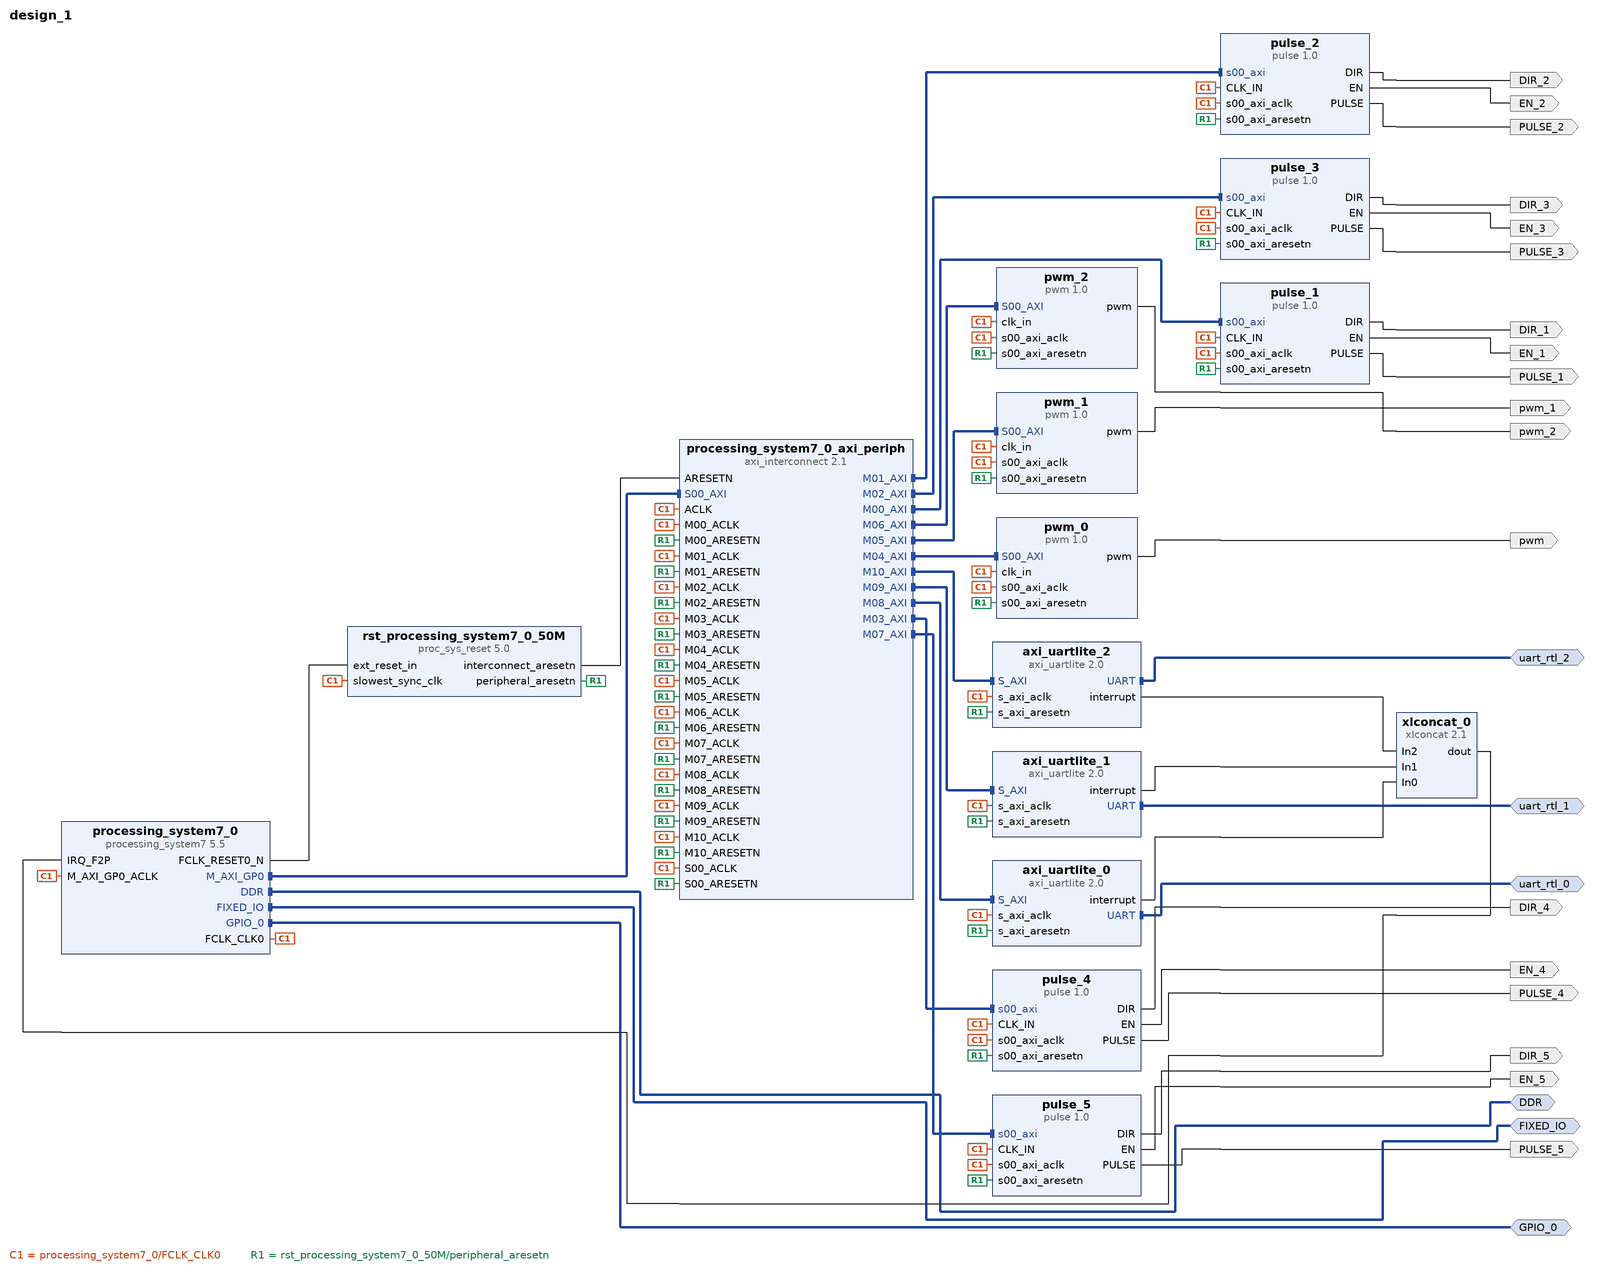
[diagram p0: block diagram of the top level]
# Vivado block design design_1, Vivado 2015.4
create_bd_design design_1

create_bd_intf_port -mode Master -vlnv xilinx.com:interface:ddrx_rtl:1.0 DDR
create_bd_intf_port -mode Master -vlnv xilinx.com:display_processing_system7:fixedio_rtl:1.0 FIXED_IO
create_bd_intf_port -mode Master -vlnv xilinx.com:interface:gpio_rtl:1.0 GPIO_0
create_bd_intf_port -mode Master -vlnv xilinx.com:interface:uart_rtl:1.0 uart_rtl_0
create_bd_intf_port -mode Master -vlnv xilinx.com:interface:uart_rtl:1.0 uart_rtl_1
create_bd_intf_port -mode Master -vlnv xilinx.com:interface:uart_rtl:1.0 uart_rtl_2
create_bd_port -dir O PULSE_1
create_bd_port -dir O EN_1
create_bd_port -dir O DIR_1
create_bd_port -dir O PULSE_2
create_bd_port -dir O EN_2
create_bd_port -dir O DIR_2
create_bd_port -dir O PULSE_3
create_bd_port -dir O EN_3
create_bd_port -dir O DIR_3
create_bd_port -dir O PULSE_4
create_bd_port -dir O EN_4
create_bd_port -dir O DIR_4
create_bd_port -dir O pwm
create_bd_port -dir O pwm_1
create_bd_port -dir O pwm_2
create_bd_port -dir O PULSE_5
create_bd_port -dir O EN_5
create_bd_port -dir O DIR_5

create_bd_cell -type ip -vlnv xilinx.com:ip:processing_system7:5.5 processing_system7_0
set_property -dict [list \
  CONFIG.PCW_SDIO_PERIPHERAL_FREQMHZ 125 \
  CONFIG.PCW_USE_FABRIC_INTERRUPT 1 \
  CONFIG.PCW_IRQ_F2P_INTR 1 \
  CONFIG.PCW_PRESET_BANK1_VOLTAGE {LVCMOS 1.8V} \
  CONFIG.PCW_UIPARAM_DDR_PARTNO {MT41J256M16 RE-125} \
  CONFIG.PCW_QSPI_PERIPHERAL_ENABLE 1 \
  CONFIG.PCW_QSPI_QSPI_IO {MIO 1 .. 6} \
  CONFIG.PCW_QSPI_GRP_SINGLE_SS_ENABLE 1 \
  CONFIG.PCW_QSPI_GRP_FBCLK_ENABLE 1 \
  CONFIG.PCW_QSPI_GRP_FBCLK_IO {MIO 8} \
  CONFIG.PCW_ENET0_PERIPHERAL_ENABLE 1 \
  CONFIG.PCW_ENET0_ENET0_IO {MIO 16 .. 27} \
  CONFIG.PCW_ENET0_GRP_MDIO_ENABLE 1 \
  CONFIG.PCW_ENET0_GRP_MDIO_IO {MIO 52 .. 53} \
  CONFIG.PCW_SD0_PERIPHERAL_ENABLE 1 \
  CONFIG.PCW_SD0_SD0_IO {MIO 40 .. 45} \
  CONFIG.PCW_SD0_GRP_CD_ENABLE 1 \
  CONFIG.PCW_SD0_GRP_CD_IO {MIO 46} \
  CONFIG.PCW_SD0_GRP_WP_ENABLE 1 \
  CONFIG.PCW_SD0_GRP_WP_IO {MIO 47} \
  CONFIG.PCW_UART0_PERIPHERAL_ENABLE 1 \
  CONFIG.PCW_UART0_UART0_IO {MIO 10 .. 11} \
  CONFIG.PCW_UART1_PERIPHERAL_ENABLE 1 \
  CONFIG.PCW_UART1_UART1_IO {MIO 48 .. 49} \
  CONFIG.PCW_CAN0_PERIPHERAL_ENABLE 1 \
  CONFIG.PCW_CAN0_CAN0_IO {MIO 14 .. 15} \
  CONFIG.PCW_TTC0_PERIPHERAL_ENABLE 1 \
  CONFIG.PCW_TTC0_TTC0_IO EMIO \
  CONFIG.PCW_USB0_PERIPHERAL_ENABLE 1 \
  CONFIG.PCW_USB0_USB0_IO {MIO 28 .. 39} \
  CONFIG.PCW_USB0_RESET_ENABLE 1 \
  CONFIG.PCW_USB0_RESET_IO {MIO 7} \
  CONFIG.PCW_I2C1_PERIPHERAL_ENABLE 1 \
  CONFIG.PCW_I2C1_I2C1_IO {MIO 12 .. 13} \
  CONFIG.PCW_GPIO_MIO_GPIO_ENABLE 1 \
  CONFIG.PCW_GPIO_MIO_GPIO_IO MIO \
  CONFIG.PCW_GPIO_EMIO_GPIO_ENABLE 1 \
  CONFIG.PCW_GPIO_EMIO_GPIO_IO 12 \
] [get_bd_cells processing_system7_0]
# 3 more settings of processing_system7_0 are not shown: defaults, MIO pin electricals, DDR timing, and values the tool derives
create_bd_cell -type ip -vlnv xilinx.com:user:pulse:1.0 pulse_1
create_bd_cell -type ip -vlnv xilinx.com:user:pulse:1.0 pulse_2
create_bd_cell -type ip -vlnv xilinx.com:user:pulse:1.0 pulse_3
create_bd_cell -type ip -vlnv xilinx.com:user:pulse:1.0 pulse_4
create_bd_cell -type ip -vlnv xilinx.com:ip:proc_sys_reset:5.0 rst_processing_system7_0_50M
create_bd_cell -type ip -vlnv xilinx.com:user:pwm:1.0 pwm_0
create_bd_cell -type ip -vlnv xilinx.com:user:pwm:1.0 pwm_1
create_bd_cell -type ip -vlnv xilinx.com:user:pwm:1.0 pwm_2
create_bd_cell -type ip -vlnv xilinx.com:user:pulse:1.0 pulse_5
create_bd_cell -type ip -vlnv xilinx.com:ip:axi_uartlite:2.0 axi_uartlite_0
set_property -dict {CONFIG.C_BAUDRATE 9600} [get_bd_cells axi_uartlite_0]
create_bd_cell -type ip -vlnv xilinx.com:ip:axi_uartlite:2.0 axi_uartlite_1
set_property -dict {CONFIG.C_BAUDRATE 57600} [get_bd_cells axi_uartlite_1]
create_bd_cell -type ip -vlnv xilinx.com:ip:axi_uartlite:2.0 axi_uartlite_2
create_bd_cell -type ip -vlnv xilinx.com:ip:axi_interconnect:2.1 processing_system7_0_axi_periph
set_property -dict {CONFIG.NUM_MI 11} [get_bd_cells processing_system7_0_axi_periph]
create_bd_cell -type ip -vlnv xilinx.com:ip:xlconcat:2.1 xlconcat_0
set_property -dict {CONFIG.NUM_PORTS 3} [get_bd_cells xlconcat_0]

# ---- connections ----

connect_bd_intf_net [get_bd_intf_pins processing_system7_0/M_AXI_GP0] [get_bd_intf_pins processing_system7_0_axi_periph/S00_AXI]
connect_bd_intf_net [get_bd_intf_pins processing_system7_0_axi_periph/M00_AXI] [get_bd_intf_pins pulse_1/s00_axi]
connect_bd_intf_net [get_bd_intf_pins processing_system7_0_axi_periph/M01_AXI] [get_bd_intf_pins pulse_2/s00_axi]
connect_bd_intf_net [get_bd_intf_pins processing_system7_0_axi_periph/M02_AXI] [get_bd_intf_pins pulse_3/s00_axi]
connect_bd_intf_net [get_bd_intf_pins processing_system7_0_axi_periph/M03_AXI] [get_bd_intf_pins pulse_4/s00_axi]
connect_bd_intf_net [get_bd_intf_pins processing_system7_0_axi_periph/M04_AXI] [get_bd_intf_pins pwm_0/S00_AXI]
connect_bd_intf_net [get_bd_intf_pins processing_system7_0_axi_periph/M05_AXI] [get_bd_intf_pins pwm_1/S00_AXI]
connect_bd_intf_net [get_bd_intf_pins processing_system7_0_axi_periph/M06_AXI] [get_bd_intf_pins pwm_2/S00_AXI]
connect_bd_intf_net [get_bd_intf_pins processing_system7_0_axi_periph/M07_AXI] [get_bd_intf_pins pulse_5/s00_axi]
connect_bd_intf_net [get_bd_intf_pins processing_system7_0_axi_periph/M08_AXI] [get_bd_intf_pins axi_uartlite_0/S_AXI]
connect_bd_intf_net [get_bd_intf_pins processing_system7_0_axi_periph/M09_AXI] [get_bd_intf_pins axi_uartlite_1/S_AXI]
connect_bd_intf_net [get_bd_intf_pins processing_system7_0_axi_periph/M10_AXI] [get_bd_intf_pins axi_uartlite_2/S_AXI]
connect_bd_intf_net [get_bd_intf_ports DDR] [get_bd_intf_pins processing_system7_0/DDR]
connect_bd_intf_net [get_bd_intf_ports FIXED_IO] [get_bd_intf_pins processing_system7_0/FIXED_IO]
connect_bd_intf_net [get_bd_intf_ports GPIO_0] [get_bd_intf_pins processing_system7_0/GPIO_0]
connect_bd_intf_net [get_bd_intf_ports uart_rtl_0] [get_bd_intf_pins axi_uartlite_0/UART]
connect_bd_intf_net [get_bd_intf_ports uart_rtl_1] [get_bd_intf_pins axi_uartlite_1/UART]
connect_bd_intf_net [get_bd_intf_ports uart_rtl_2] [get_bd_intf_pins axi_uartlite_2/UART]
connect_bd_net [get_bd_pins processing_system7_0/FCLK_CLK0] \
  [get_bd_pins processing_system7_0/M_AXI_GP0_ACLK] [get_bd_pins rst_processing_system7_0_50M/slowest_sync_clk] \
  [get_bd_pins pulse_1/s00_axi_aclk] [get_bd_pins pulse_2/s00_axi_aclk] [get_bd_pins pulse_3/s00_axi_aclk] \
  [get_bd_pins pulse_4/s00_axi_aclk] [get_bd_pins pulse_1/CLK_IN] [get_bd_pins pulse_2/CLK_IN] [get_bd_pins pulse_3/CLK_IN] \
  [get_bd_pins pulse_4/CLK_IN] [get_bd_pins pwm_0/s00_axi_aclk] [get_bd_pins pwm_1/s00_axi_aclk] \
  [get_bd_pins pwm_2/s00_axi_aclk] [get_bd_pins pwm_0/clk_in] [get_bd_pins pwm_1/clk_in] [get_bd_pins pwm_2/clk_in] \
  [get_bd_pins pulse_5/s00_axi_aclk] [get_bd_pins axi_uartlite_0/s_axi_aclk] [get_bd_pins axi_uartlite_1/s_axi_aclk] \
  [get_bd_pins axi_uartlite_2/s_axi_aclk] [get_bd_pins pulse_5/CLK_IN] [get_bd_pins processing_system7_0_axi_periph/S00_ACLK] \
  [get_bd_pins processing_system7_0_axi_periph/ACLK] [get_bd_pins processing_system7_0_axi_periph/M00_ACLK] \
  [get_bd_pins processing_system7_0_axi_periph/M01_ACLK] [get_bd_pins processing_system7_0_axi_periph/M02_ACLK] \
  [get_bd_pins processing_system7_0_axi_periph/M03_ACLK] [get_bd_pins processing_system7_0_axi_periph/M04_ACLK] \
  [get_bd_pins processing_system7_0_axi_periph/M05_ACLK] [get_bd_pins processing_system7_0_axi_periph/M06_ACLK] \
  [get_bd_pins processing_system7_0_axi_periph/M07_ACLK] [get_bd_pins processing_system7_0_axi_periph/M08_ACLK] \
  [get_bd_pins processing_system7_0_axi_periph/M09_ACLK] [get_bd_pins processing_system7_0_axi_periph/M10_ACLK]
connect_bd_net [get_bd_pins processing_system7_0/FCLK_RESET0_N] [get_bd_pins rst_processing_system7_0_50M/ext_reset_in]
connect_bd_net [get_bd_pins rst_processing_system7_0_50M/peripheral_aresetn] \
  [get_bd_pins pulse_1/s00_axi_aresetn] [get_bd_pins pulse_2/s00_axi_aresetn] [get_bd_pins pulse_3/s00_axi_aresetn] \
  [get_bd_pins pulse_4/s00_axi_aresetn] [get_bd_pins pwm_0/s00_axi_aresetn] [get_bd_pins pwm_1/s00_axi_aresetn] \
  [get_bd_pins pwm_2/s00_axi_aresetn] [get_bd_pins pulse_5/s00_axi_aresetn] [get_bd_pins axi_uartlite_0/s_axi_aresetn] \
  [get_bd_pins axi_uartlite_1/s_axi_aresetn] [get_bd_pins axi_uartlite_2/s_axi_aresetn] \
  [get_bd_pins processing_system7_0_axi_periph/S00_ARESETN] [get_bd_pins processing_system7_0_axi_periph/M00_ARESETN] \
  [get_bd_pins processing_system7_0_axi_periph/M01_ARESETN] [get_bd_pins processing_system7_0_axi_periph/M02_ARESETN] \
  [get_bd_pins processing_system7_0_axi_periph/M03_ARESETN] [get_bd_pins processing_system7_0_axi_periph/M04_ARESETN] \
  [get_bd_pins processing_system7_0_axi_periph/M05_ARESETN] [get_bd_pins processing_system7_0_axi_periph/M06_ARESETN] \
  [get_bd_pins processing_system7_0_axi_periph/M07_ARESETN] [get_bd_pins processing_system7_0_axi_periph/M08_ARESETN] \
  [get_bd_pins processing_system7_0_axi_periph/M09_ARESETN] [get_bd_pins processing_system7_0_axi_periph/M10_ARESETN]
connect_bd_net [get_bd_pins pulse_1/PULSE] [get_bd_ports PULSE_1]
connect_bd_net [get_bd_pins pulse_1/EN] [get_bd_ports EN_1]
connect_bd_net [get_bd_pins pulse_1/DIR] [get_bd_ports DIR_1]
connect_bd_net [get_bd_pins pulse_2/PULSE] [get_bd_ports PULSE_2]
connect_bd_net [get_bd_pins pulse_2/EN] [get_bd_ports EN_2]
connect_bd_net [get_bd_pins pulse_2/DIR] [get_bd_ports DIR_2]
connect_bd_net [get_bd_pins pulse_3/PULSE] [get_bd_ports PULSE_3]
connect_bd_net [get_bd_pins pulse_3/EN] [get_bd_ports EN_3]
connect_bd_net [get_bd_pins pulse_3/DIR] [get_bd_ports DIR_3]
connect_bd_net [get_bd_pins pulse_4/PULSE] [get_bd_ports PULSE_4]
connect_bd_net [get_bd_pins pulse_4/EN] [get_bd_ports EN_4]
connect_bd_net [get_bd_pins pulse_4/DIR] [get_bd_ports DIR_4]
connect_bd_net [get_bd_pins pwm_0/pwm] [get_bd_ports pwm]
connect_bd_net [get_bd_pins pwm_1/pwm] [get_bd_ports pwm_1]
connect_bd_net [get_bd_pins pwm_2/pwm] [get_bd_ports pwm_2]
connect_bd_net [get_bd_pins pulse_5/PULSE] [get_bd_ports PULSE_5]
connect_bd_net [get_bd_pins pulse_5/EN] [get_bd_ports EN_5]
connect_bd_net [get_bd_pins pulse_5/DIR] [get_bd_ports DIR_5]
connect_bd_net [get_bd_pins rst_processing_system7_0_50M/interconnect_aresetn] [get_bd_pins processing_system7_0_axi_periph/ARESETN]
connect_bd_net [get_bd_pins axi_uartlite_0/interrupt] [get_bd_pins xlconcat_0/In0]
connect_bd_net [get_bd_pins axi_uartlite_1/interrupt] [get_bd_pins xlconcat_0/In1]
connect_bd_net [get_bd_pins axi_uartlite_2/interrupt] [get_bd_pins xlconcat_0/In2]
connect_bd_net [get_bd_pins xlconcat_0/dout] [get_bd_pins processing_system7_0/IRQ_F2P]

# ---- address map ----
assign_bd_address -offset 0x42C00000 -range 64K -target_address_space [get_bd_addr_spaces processing_system7_0/Data] [get_bd_addr_segs axi_uartlite_0/S_AXI/Reg]
assign_bd_address -offset 0x42C10000 -range 64K -target_address_space [get_bd_addr_spaces processing_system7_0/Data] [get_bd_addr_segs axi_uartlite_1/S_AXI/Reg]
assign_bd_address -offset 0x42C20000 -range 64K -target_address_space [get_bd_addr_spaces processing_system7_0/Data] [get_bd_addr_segs axi_uartlite_2/S_AXI/Reg]
assign_bd_address -offset 0x43C00000 -range 64K -target_address_space [get_bd_addr_spaces processing_system7_0/Data] [get_bd_addr_segs pulse_1/s00_axi/reg0]
assign_bd_address -offset 0x43C10000 -range 64K -target_address_space [get_bd_addr_spaces processing_system7_0/Data] [get_bd_addr_segs pulse_2/s00_axi/reg0]
assign_bd_address -offset 0x43C20000 -range 64K -target_address_space [get_bd_addr_spaces processing_system7_0/Data] [get_bd_addr_segs pulse_3/s00_axi/reg0]
assign_bd_address -offset 0x43C30000 -range 64K -target_address_space [get_bd_addr_spaces processing_system7_0/Data] [get_bd_addr_segs pulse_4/s00_axi/reg0]
assign_bd_address -offset 0x43C40000 -range 64K -target_address_space [get_bd_addr_spaces processing_system7_0/Data] [get_bd_addr_segs pulse_5/s00_axi/reg0]
assign_bd_address -offset 0x43C50000 -range 64K -target_address_space [get_bd_addr_spaces processing_system7_0/Data] [get_bd_addr_segs pwm_0/S00_AXI/S00_AXI_reg]
assign_bd_address -offset 0x43C60000 -range 64K -target_address_space [get_bd_addr_spaces processing_system7_0/Data] [get_bd_addr_segs pwm_1/S00_AXI/S00_AXI_reg]
assign_bd_address -offset 0x43C70000 -range 64K -target_address_space [get_bd_addr_spaces processing_system7_0/Data] [get_bd_addr_segs pwm_2/S00_AXI/S00_AXI_reg]

validate_bd_design
save_bd_design
